# Altium schematic sheet QSPI.SchDoc: Quad SPI Flash Memory (MICRON)
size A4; Author: N.P; CompanyName: STMicroelectronics; Organization: MCD/APPLIS/LMS; DocumentNumber: MB1260; SheetNumber: 7; SheetTotal: 13; Project: STM32F723e-DISCO
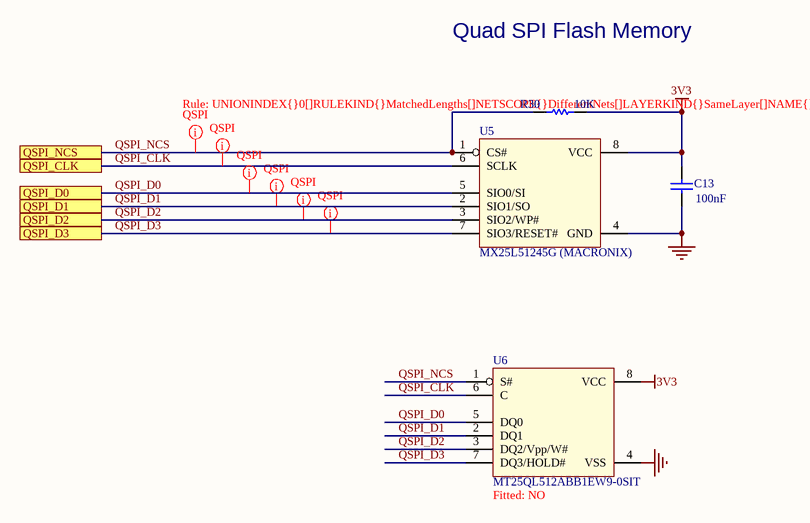
[diagram p0: QSPI.SchDoc]

## Parts
C13  100nF  [0402C]
R30  10K  [0402R]
U5  MX25L51245G (MACRONIX)  [SON8_1R27_6X8]
U6  MT25QL512ABB1EW9-0SIT  Fitted: NO  [DFN8_1R27_6X8_TP4R6X5R3]

## Ports
QSPI_CLK, QSPI_D0, QSPI_D1, QSPI_D2, QSPI_D3, QSPI_NCS

## Nets
3V3: C13.2 R30.2 U5.8(VCC) U6.8(VCC)
GND: C13.1 U5.4(GND) U6.4(VSS)
QSPI_CLK: U5.6(SCLK) U6.6(C) ; port QSPI_CLK
QSPI_D0: U5.5(SIO0/SI) U6.5(DQ0) ; port QSPI_D0
QSPI_D1: U5.2(SIO1/SO) U6.2(DQ1) ; port QSPI_D1
QSPI_D2: U5.3(SIO2/WP#) U6.3(DQ2/Vpp/W#) ; port QSPI_D2
QSPI_D3: U5.7(SIO3/RESET#) U6.7(DQ3/HOLD#) ; port QSPI_D3
QSPI_NCS: R30.1 U5.1(CS#) U6.1(S#) ; port QSPI_NCS

## Layout directives
rule Matched Net Lengths [Tolerance = 100mil]: QSPI_CLK, QSPI_D0, QSPI_D1, QSPI_D2, QSPI_D3, QSPI_NCS

## Notes on the sheet
- Quad SPI Flash Memory
- Title:
- Project:
- Size:
- Revision:
- Variant:
- A4
- -
- Date:
- Reference:
- Sheet:
- of

## Library data of the parts
C13 = Cap_100nF_X7R_10%_0402: Capacitor,100nF,16V,X7R,10%,0402,YAGEO; Manuf_Part_1: CC0402KRX7R7BB104; Ordered by: Subcon; Fitted: YES; Revision: July-2002: Re-released for DXP Platform.; Value: 100nF; Order: CC0402KRX7R7BB104; Manuf_1: YAGEO; ECCN_US/EU: n/a
R30 = Res_10K_1%_0402: Resistor,10K,0402,1%,YAGEO; Manuf_Part_1: RC0402FR-0710KL; Ordered by: Subcon; Fitted: YES; Value: 10K; Manuf_1: YAGEO; Order: RC0402FR-0710KL; ECCN_US/EU: n/a
U5 = MX25L51245G: 512Mb, 3V, Multiple I/O Serial Flash Memory, Quad/Dual; Manuf_Part_1: MX25L51245GZ2I-08G; Manuf_Part_2: MX25L51245GZ2I-10G; Provided: Subcon; Ref St: xxxxxxxxxx; Fitted: YES; ECCN_US/EU: n/a; Manuf_1: MACRONIX; Distrib: MACRONIX; Ordered by: Subcon
U6 = N25Q512A13GF840E: 512Mb, 3V, Multiple I/O Serial Flash Memory, Quad/Dual; Manuf_1: MICRON; Provided: ST; Distrib: MICRON; Manuf_Part_1: MT25QL512ABB1EW9-0SIT; Ordered by: ST